# Altium schematic sheet Rectifier.SchDoc
size A4; DocumentNumber: 14; SheetNumber: 12; SheetTotal: 14
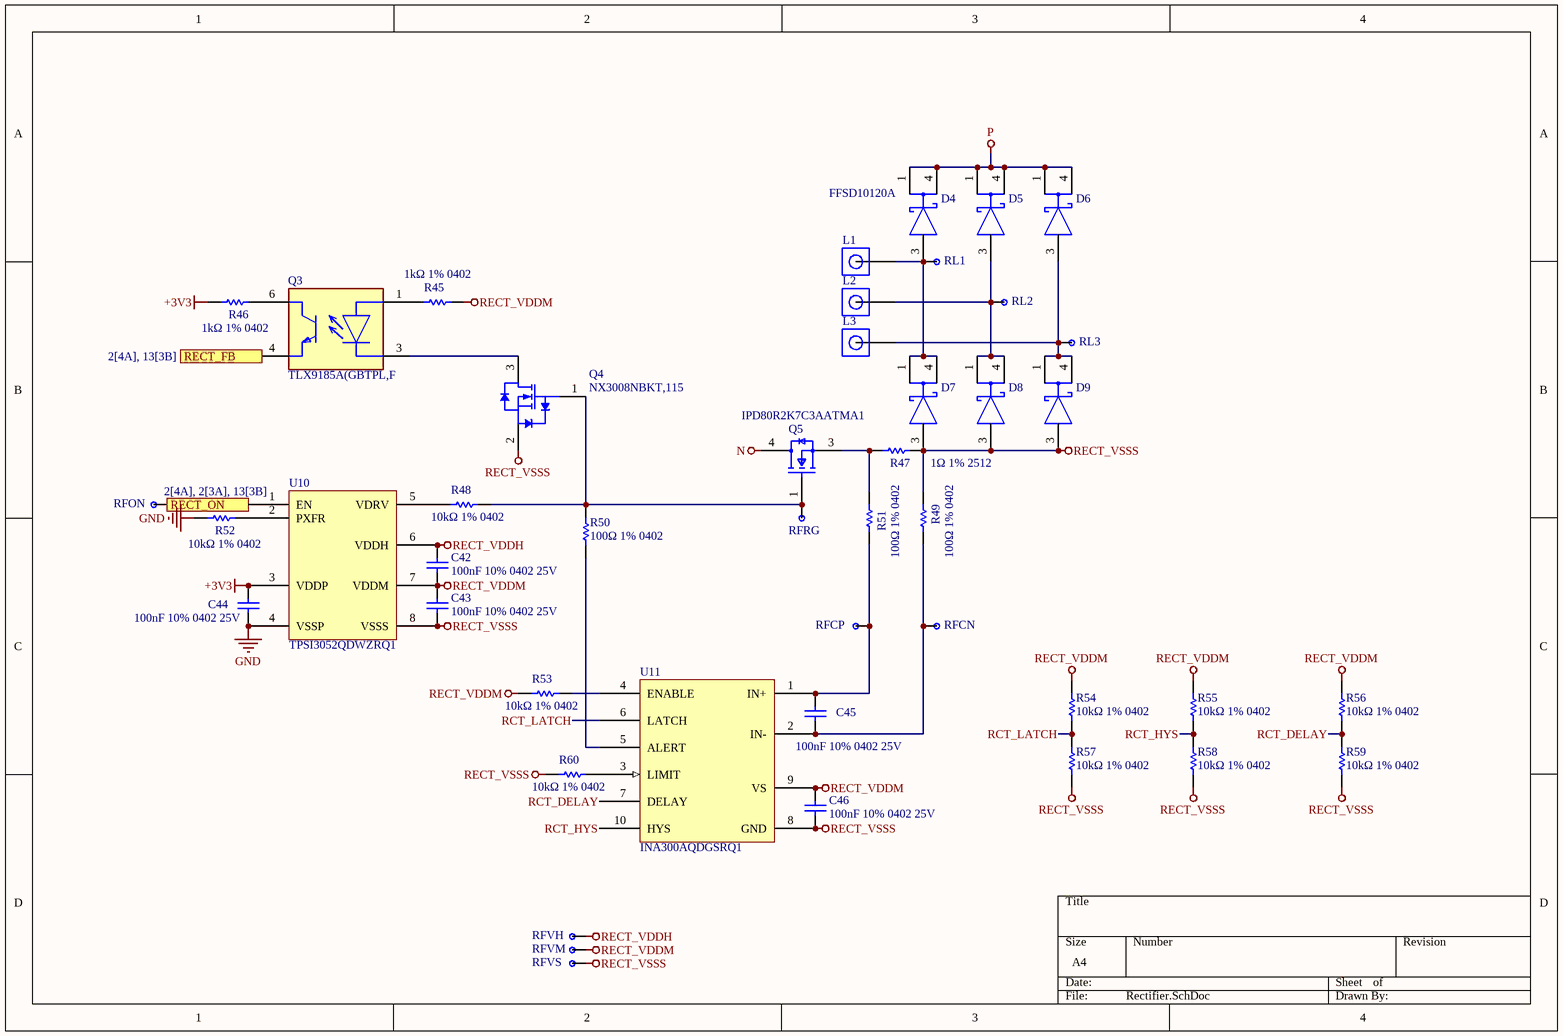
[diagram p0: Rectifier.SchDoc]

## Parts
C42  100nF 10% 0402 25V  [0402N]
C43  100nF 10% 0402 25V  [0402N]
C44  100nF 10% 0402 25V  [0402N]
C45  100nF 10% 0402 25V  [0402N]
C46  100nF 10% 0402 25V  [0402N]
D4  FFSD10120A  [FP-369AS-MFG]
D5  FFSD10120A  [FP-369AS-MFG]  (value not drawn)
D6  FFSD10120A  [FP-369AS-MFG]  (value not drawn)
D7  FFSD10120A  [FP-369AS-MFG]  (value not drawn)
D8  FFSD10120A  [FP-369AS-MFG]  (value not drawn)
D9  FFSD10120A  [FP-369AS-MFG]  (value not drawn)
L1  Pad  [Pad-Footprint-2]  (value not drawn)  (no BOM)
L2  Pad  [Pad-Footprint-2]  (value not drawn)  (no BOM)
L3  Pad  [Pad-Footprint-2]  (value not drawn)  (no BOM)
Q3  TLX9185A(GBTPL,F  [FP-11-4M1S-MFG]
Q4  NX3008NBKT,115  [NXP-SOT416_B_L]
Q5  IPD80R2K7C3AATMA1  [FP-PG-TO252-3-MFG]
R45  1kΩ 1% 0402  [0402N]
R46  1kΩ 1% 0402  [0402N]
R47  1Ω 1% 2512  [2512L]
R48  10kΩ 1% 0402  [0402N]
R49  100Ω 1% 0402  [0402N]
R50  100Ω 1% 0402  [0402N]
R51  100Ω 1% 0402  [0402N]
R52  10kΩ 1% 0402  [0402N]
R53  10kΩ 1% 0402  [0402N]
R54  10kΩ 1% 0402  [0402N]
R55  10kΩ 1% 0402  [0402N]
R56  10kΩ 1% 0402  [0402N]
R57  10kΩ 1% 0402  [0402N]
R58  10kΩ 1% 0402  [0402N]
R59  10kΩ 1% 0402  [0402N]
R60  10kΩ 1% 0402  [0402N]
RFCN  Testpoint  [Testpoint-Footprint-1]  (value not drawn)  (no BOM)
RFCP  Testpoint  [Testpoint-Footprint-1]  (value not drawn)  (no BOM)
RFON  Testpoint  [Testpoint-Footprint-1]  (value not drawn)  (no BOM)
RFRG  Testpoint  [Testpoint-Footprint-1]  (value not drawn)  (no BOM)
RFVH  Testpoint  [Testpoint-Footprint-1]  (value not drawn)  (no BOM)
RFVM  Testpoint  [Testpoint-Footprint-1]  (value not drawn)  (no BOM)
RFVS  Testpoint  [Testpoint-Footprint-1]  (value not drawn)  (no BOM)
RL1  Testpoint  [Testpoint-Footprint-1]  (value not drawn)  (no BOM)
RL2  Testpoint  [Testpoint-Footprint-1]  (value not drawn)  (no BOM)
RL3  Testpoint  [Testpoint-Footprint-1]  (value not drawn)  (no BOM)
U10  TPSI3052QDWZRQ1  [TPSI3052QDWZRQ1-Footprint-1]
U11  INA300AQDGSRQ1  [INA300AQDGSRQ1-Footprint-2]

## Ports
RECT_FB (out, see 2[4A], 13[3B]), RECT_ON (in, see 2[4A], 2[3A], 13[3B])

## Nets
+3V3: C44.2 R46.1 U10.3(VDDP)
GND: C44.1 R52.1 U10.4(VSSP)
N: Q5.4(drain)
P: D4.1(C) D4.4(C) D5.1(C) D5.4(C) D6.1(C) D6.4(C)
RECT_VDDH: C42.1 RFVH.1 U10.6(VDDH)
RECT_VDDM: C42.2 C43.1 C46.1 R45.1 R53.1 R54.2 R55.2 R56.2 RFVM.1 U10.7(VDDM) U11.9(VS)
RECT_VSSS: C43.2 C46.2 D7.3(A) D8.3(A) D9.3(A) Q4.2(S) R47.2 R49.2 R57.1 R58.1 R59.1 R60.2 RFVS.1 U10.8(VSSS) U11.8(GND)
RCT_DELAY: R56.1 R59.2 U11.7(DELAY)
RCT_HYS: R55.1 R58.2 U11.10(HYS)
RCT_LATCH: R54.1 R57.2 U11.6(LATCH)
RECT_FB: Q3.4(E) ; port RECT_FB
RECT_ON: RFON.1 U10.1(EN) ; port RECT_ON
NetC45_1: C45.1 R49.1 RFCN.1 U11.2(IN-)
NetC45_2: C45.2 R51.1 RFCP.1 U11.1(IN+)
NetD4_3: D4.3(A) D7.1(C) D7.4(C) L1.1 RL1.1
NetD5_3: D5.3(A) D8.1(C) D8.4(C) L2.1 RL2.1
NetD6_3: D6.3(A) D9.1(C) D9.4(C) L3.1 RL3.1
NetQ3_1: Q3.1(A) R45.2
NetQ3_3: Q3.3(C) Q4.3(D)
NetQ3_6: Q3.6(C) R46.2
NetQ4_1: Q4.1(G) Q5.1(gate) R48.1 R50.2 RFRG.1
NetQ5_3: Q5.3(source) R47.1 R51.2
NetR48_2: R48.2 U10.5(VDRV)
NetR50_1: R50.1 U11.5(ALERT)
NetR52_2: R52.2 U10.2(PXFR)
NetR53_2: R53.2 U11.4(ENABLE)
NetR60_1: R60.1 U11.3(LIMIT)

## Library data of the parts
C42-C46 = C0402: Capacitance: 100n; Tolerance: 10; Voltage: 25; Footprint: 0402
D4-D9 = CMP-00278-84326837-1: FFSD10120A Rectifier Diode Schottky SiC 1.2KV 22A 3-Pin(2+Tab) DPAK T/R; Manufacturer Lifecycle Status: ACTIVE; Peak Reverse Current: 200µA; Capacitance: 612pF; Max Junction Temperature (Tj): 175°C; Element Configuration: Single; Max Forward Surge Current (Ifsm): 90A; Min Operating Temperature: -55°C; Max Repetitive Reverse Voltage (Vrrm): 1.2kV; Forward Current: 22A; Max Operating Temperature: 175°C; Weight: 260.37mg; Lifecycle Status: Production; RoHS: Compliant; Height: 2.517mm; NexarPartId: 84326837; Mount: Surface Mount
L1-L3 = CMP-003-000003-3: Single Pad
Q3 = CMP-35887-000017-1: TR COUPLER; 4-PIN SO6; AECQ; ROH
Q4 = CMP-1259-00268-1: N-Channel Trench MOSFET, 30 V, 0.35 A, -55 to 150 degC, 3-Pin SOT416, Tape and Reel; Manufacturer: NXP Semiconductors; Automotive Qualified: Y; ID [max] (A): 0.35; IDM [max] (A): 1.4; VDS [max] (V): 30; Channel Type: N; VGSth [typ] (V): 0.9; Packing: Tape & Reel; DatasheetVersion: Rev. 1; PackageVersion: 06-03-16, 03/2006; ComponentLink2Description: Datasheet; PartNumber: NX3008NBKT,115; ComponentLink3URL: http://www.nxp.com/documents/data_sheet/2N7002PT.pdf; ComponentLink2URL: http://www.nxp.com/documents/data_sheet/NX3008NBKT.pdf; Code_JEITA: SC-75; PackageReference: SOT416_B; ComponentLink3Description: Package Specification; PackageDescription: 3-Pin Small Outline Transistor Package, Body 1.6 x 0.8 mm, Pitch 0.5 mm; Mounting Technology: Surface Mount; ComponentLink1URL: http://www.nxp.com/; ComponentLink1Description: Manufacturer URL
Q5 = CMP-32901-001052-1: MOSFET N-CH TO252-3; Drain to Source Voltage (Vdss): 800V; RoHS Compliant: Yes; Lead Free: Contains Lead; Halogen Free: Halogen Free; Series: *; Mount: Surface Mount; Max Dual Supply Voltage: 800V
R45 R46 = R0402: Resistance: 1k; Tolerance: 1; Footprint: 0402
R47 = R2512: Resistance: 1; Tolerance: 1; Footprint: 2512
R48 R52-R60 = R0402: Resistance: 10k; Tolerance: 1; Footprint: 0402
R49-R51 = R0402: Resistance: 100; Tolerance: 1; Footprint: 0402
RFCN RFCP RFON RFRG RFVH RFVM RFVS RL1-RL3 = CMP-003-000002-1
U10 = CMP-00024-00007-1: Automotive reinforced isolated switch driver with integrated 15-V gate supply 8-SO-MOD -40 to 125
U11 = CMP-014-00003-1: Comparator, 1 Func, -650uV Offset-Max, 100000ns Response Time, PDSO10; RoHS Compliant: Yes